# EAGLE design Bio-Belt_TH (EAGLE 5.06)
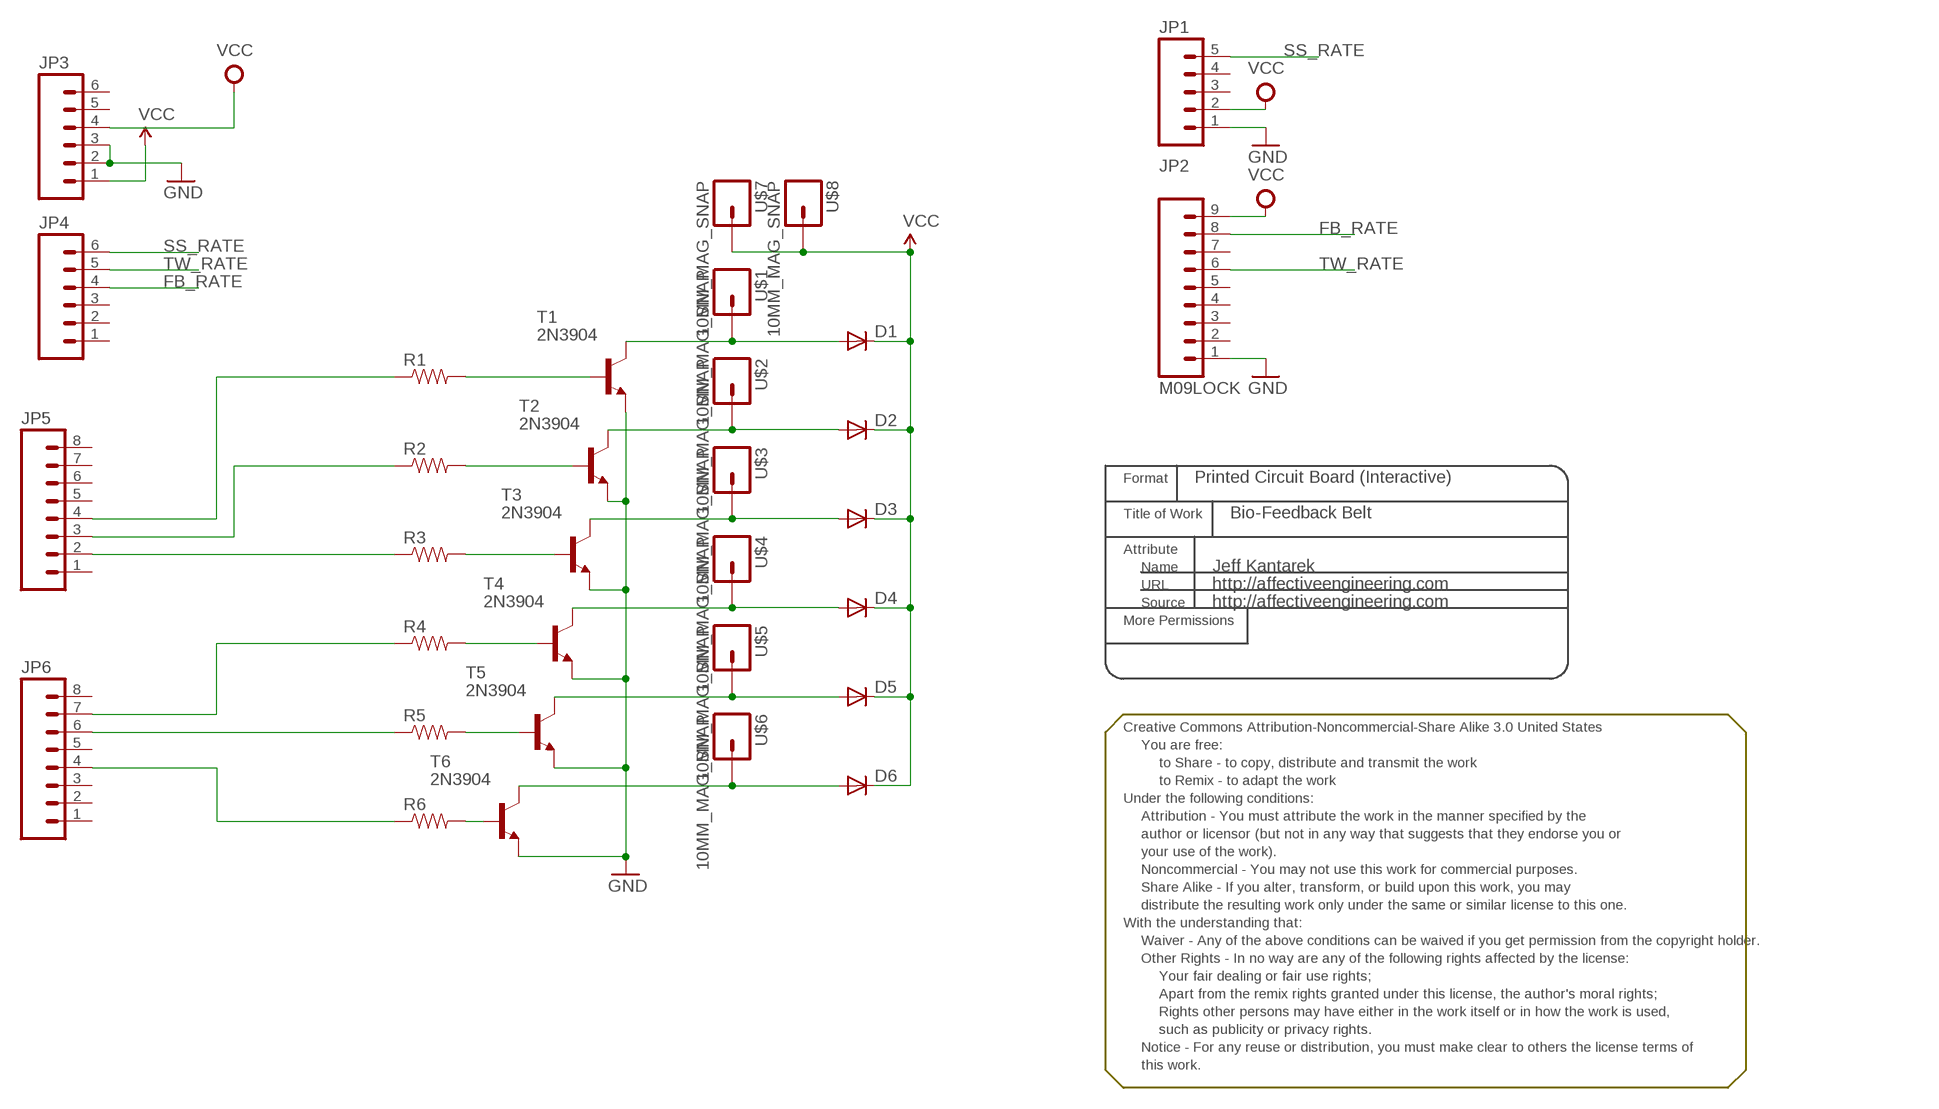
[diagram p0: schematic, sheet 1]

## Parts
D1  DIODEPTH  [DIODE-1N4001]
D2  DIODEPTH  [DIODE-1N4001]
D3  DIODEPTH  [DIODE-1N4001]
D4  DIODEPTH  [DIODE-1N4001]
D5  DIODEPTH  [DIODE-1N4001]
D6  DIODEPTH  [DIODE-1N4001]
JP1  M05LOCK  [1X05_LOCK]
JP2  M09LOCK  [1X09_LOCK]
JP3  M06LOCK  [1X06_LOCK]
JP4  M06LOCK  [1X06_LOCK]
JP5  M08LOCK  [1X08_LOCK]
JP6  M08LOCK  [1X08_LOCK]
R1  RESISTORPTH1  [AXIAL-0.3]
R2  RESISTORPTH1  [AXIAL-0.3]
R3  RESISTORPTH1  [AXIAL-0.3]
R4  RESISTORPTH1  [AXIAL-0.3]
R5  RESISTORPTH1  [AXIAL-0.3]
R6  RESISTORPTH1  [AXIAL-0.3]
T1  2N3904  [TO92]
T2  2N3904  [TO92]
T3  2N3904  [TO92]
T4  2N3904  [TO92]
T5  2N3904  [TO92]
T6  2N3904  [TO92]
U$1  10MM_MAG_SNAP  [SN1X01]
U$2  10MM_MAG_SNAP  [SN1X01]
U$3  10MM_MAG_SNAP  [SN1X01]
U$4  10MM_MAG_SNAP  [SN1X01]
U$5  10MM_MAG_SNAP  [SN1X01]
U$6  10MM_MAG_SNAP  [SN1X01]
U$7  10MM_MAG_SNAP  [SN1X01]
U$8  10MM_MAG_SNAP  [SN1X01]
U$10  CC_AT_NC_SA  [CC_AT_SA_NC]

## Nets
FB_RATE: JP2.8 JP4.4
GND: JP1.1 JP2.1 JP3.2 JP3.3 T1.3(E) T2.3(E) T3.3(E) T4.3(E) T5.3(E) T6.3(E)
N$1: D1.A T1.1(C) U$1.P$5
N$2: D2.A T2.1(C) U$2.P$5
N$3: D3.A T3.1(C) U$3.P$5
N$4: D4.A T4.1(C) U$4.P$5
N$5: D5.A T5.1(C) U$5.P$5
N$6: D6.A T6.1(C) U$6.P$5
N$8: R1.P$2 T1.2(B)
N$9: R2.P$2 T2.2(B)
N$10: R3.P$2 T3.2(B)
N$11: R4.P$2 T4.2(B)
N$12: R5.P$2 T5.2(B)
N$13: R6.P$2 T6.2(B)
N$14: JP5.4 R1.P$1
N$15: JP5.3 R2.P$1
N$16: JP5.2 R3.P$1
N$17: JP6.7 R4.P$1
N$18: JP6.6 R5.P$1
N$19: JP6.4 R6.P$1
SS_RATE: JP1.5 JP4.6
TW_RATE: JP2.6 JP4.5
VCC: JP1.2 JP2.9 JP3.4
VIN: D1.C D2.C D3.C D4.C D5.C D6.C JP3.1 U$7.P$5 U$8.P$5 ; supply symbol labelled VCC
Unconnected: JP1.3 JP1.4 JP2.2 JP2.3 JP2.4 JP2.5 JP2.7 JP3.5 JP3.6 JP4.1 JP4.2 JP4.3 JP5.1 JP5.5 JP5.6 JP5.7 JP5.8 JP6.1 JP6.2 JP6.3 JP6.5 JP6.8

## Notes on the sheet
- Printed Circuit Board (Interactive)
- Bio-Feedback Belt
- Jeff Kantarek
- http://affectiveengineering.com
- http://affectiveengineering.com

## Library data of the parts
D1-D6 = SparkFun:DIODE: Diode These are standard reverse protection diodes and small signal diodes. SMA package can handle up to about 1A. SOD-323 can handle about 200mA. What the SOD-323 package when ordering, there are some mfgs out there that are 5-pin packages.
JP1 = SparkFun:M05: Header 5 Standard 5-pin 0.1" header. Use with straight break away headers (SKU : PRT-00116), right angle break away headers (PRT-00553), swiss pins (PRT-00743), machine pins (PRT-00117), and female headers (PRT-00115). Molex polarized connector foot print use with SKU : PRT-08230 with associated crimp pins and housings.
JP2 = SparkFun:M09: Header 9 Standard 9-pin 0.1" header. Use with straight break away headers (SKU : PRT-00116), right angle break away headers (PRT-00553), swiss pins (PRT-00743), machine pins (PRT-00117), and female headers (PRT-00115).
JP3 JP4 = SparkFun:M06: Header 6 Standard 6-pin 0.1" header. Use with straight break away headers (SKU : PRT-00116), right angle break away headers (PRT-00553), swiss pins (PRT-00743), machine pins (PRT-00117), and female headers (PRT-00115). Molex polarized connector foot print use with SKU : PRT-08094 with associated crimp pins and housings. NOTES ON THE VARIANTS LOCK and LOCK_LONGPADS... This footprint was designed to help hold the alignment of a through-hole component (i.e. 6-pin header) while soldering it into place. You may notice that each hole has been shifted either up or down by 0.005 of an inch from it's more standard position (which is a perfectly straight line). This slight alteration caused the pins (the squares in the middle) to touch the edges of the holes. Because they are alternating, it causes a "brace" to hold the component in place. 0.005 has proven to be the perfect amount of "off-center" position when using our standard breakaway headers. Although looks a little odd when you look at the bare footprint, once you have a header in there, the alteration is very hard to notice. Also, if you push a header all the way into place, it is covered up entirely on the bottom side. This idea of altering the position of holes to aid alignment will be further integrated into the Sparkfun Library for other footprints. It can help hold any component with 3 or more connection pins.
JP5 JP6 = SparkFun:M08: Header 8 Standard 8-pin 0.1" header. Use with straight break away headers (SKU : PRT-00116), right angle break away headers (PRT-00553), swiss pins (PRT-00743), machine pins (PRT-00117), and female headers (PRT-00115).
R1-R6 = SparkFun:RESISTOR: Resistor Basic schematic elements and footprints for 0603, 1206, and PTH 1/10th watt (small) resistors.
T1-T6 = transistor:2N3904: NPN TRANSISTOR
U$1-U$8 = SparkFun:10MM_MAG_SNAP
U$10 = PumpingStation-One:CC_AT_NC_SA: Creative Commons Attribution-Noncommercial-Share Alike 3.0 United States us You are free: * to Share ? to copy, distribute and transmit the work * to Remix ? to adapt the work * Under the following conditions: * Attribution ? You must attribute the work in the manner specified by the author or licensor (but not in any way that suggests that they endorse you or your use of the work). Attribute this work: Information What does "Attribute this work" mean? The page you came from contained embedded licensing metadata, including how the creator wishes to be attributed for re-use. You can use the HTML here to cite the work. Doing so will also include metadata on your page so that others can find the original work as well. * Noncommercial ? You may not use this work for commercial purposes. * Share Alike ? If you alter, transform, or build upon this work, you may distribute the resulting work only under the same or similar license to this one. With the understanding that: * Waiver ? Any of the above conditions can be waived if you get permission from the copyright holder. * Other Rights ? In no way are any of the following rights affected by the license: o Your fair dealing or fair use rights; o Apart from the remix rights granted under this license, the author's moral rights; o Rights other persons may have either in the work itself or in how the work is used, such as publicity or privacy rights. * Notice ? For any reuse or distribution, you must make clear to others the license terms of this work. The best way to do this is with a link to this web page.

## Board
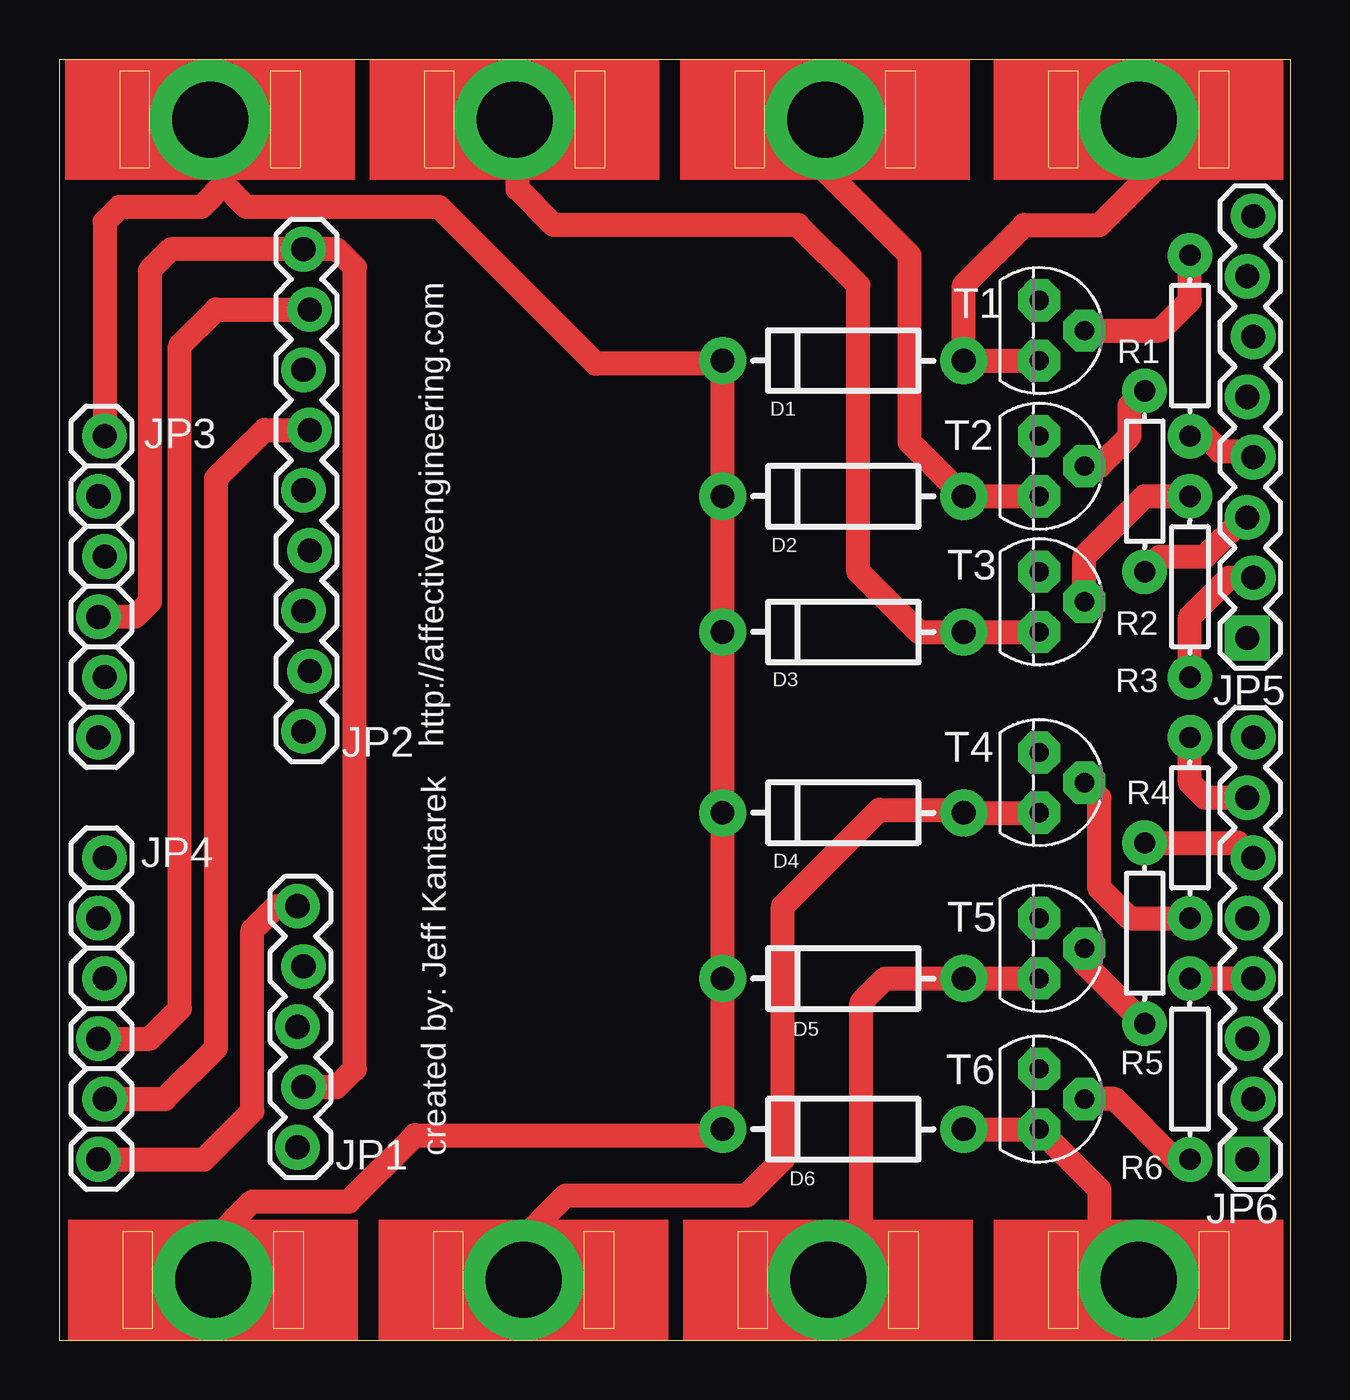
[diagram p1: board, top side]
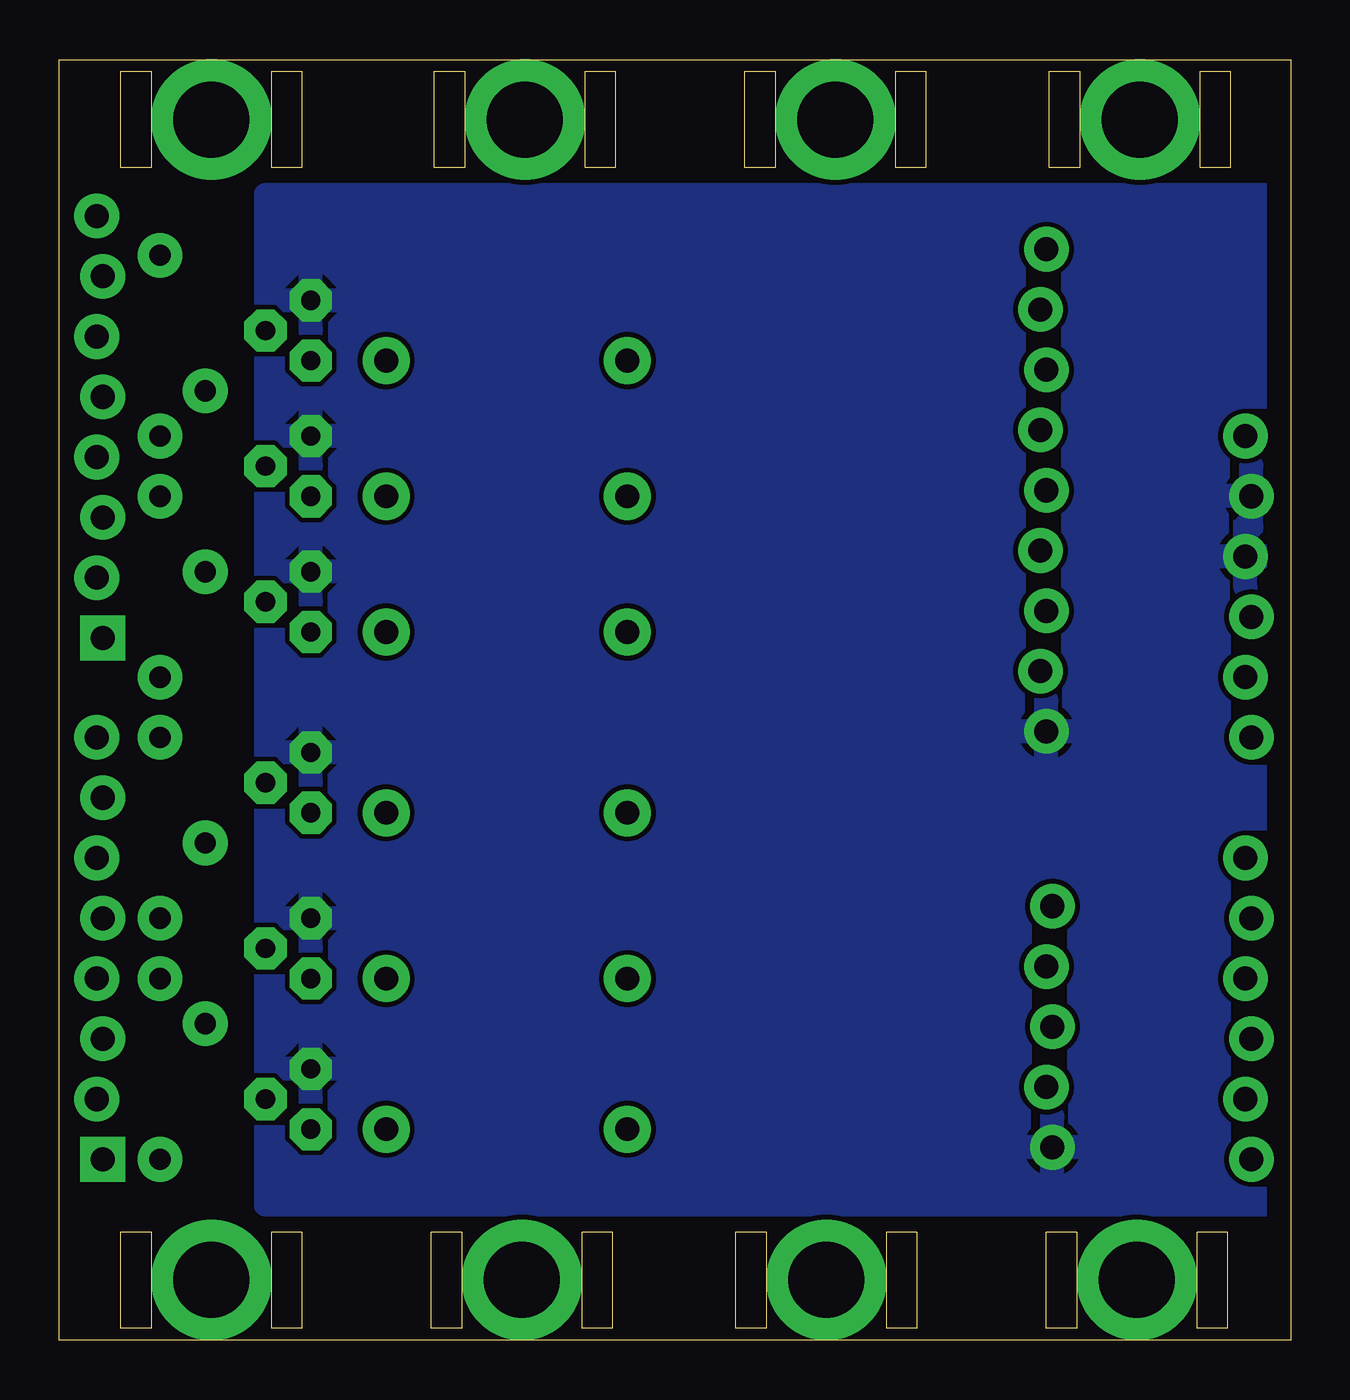
[diagram p2: board, bottom side, seen from below]

Size 51.87 x 53.97 mm. Coordinates in mm from the lower left corner, seen from the top.
Outline: 0,0 51.87,0 51.87,53.97 0,53.97 0,0
Copper layers (1*16): Top 0.035mm / dielectric 1.5mm / Bottom 0.035mm
Design rules "default": minimum track width 10mil, minimum drill 24mil, track to track 8mil, track to pad 8mil, pad to pad 8mil, via to via 8mil, smd to smd 8mil, copper to edge 40mil, drill to drill 8mil, minimum pad ring 10mil, minimum via ring 8mil, stop-mask expansion 4mil, vias tented up to drill 0mil, thermal gap 10mil

### Footprints (pad centres in the part's own frame; a part is rotated, then mirrored left to right if it is on the bottom)
DIODE-1N4001 = drill 1 pad 1.981 round: A -5.08,0; C 5.08,0
1X05_LOCK = drill 1.016 pad 1.88 round: 1 0,0.127; 2 2.54,-0.127; 3 5.08,0.127; 4 7.62,-0.127; 5 10.16,0.127
1X09_LOCK = drill 1.016 pad 1.88 round: 1 0,0.127; 2 2.54,-0.127; 3 5.08,0.127; 4 7.62,-0.127; 5 10.16,0.127; 6 12.7,-0.127; 7 15.24,0.127; 8 17.78,-0.127; 9 20.32,0.127
1X06_LOCK = drill 1.016 pad 1.88 round: 1 0,0; 2 2.54,-0.254; 3 5.08,0; 4 7.62,-0.254; 5 10.16,0; 6 12.7,-0.254
1X08_LOCK = drill 1.016 pad 1.88 square: 1 0,0.127 | drill 1.016 pad 1.88 round: 2 2.54,-0.127; 3 5.08,0.127; 4 7.62,-0.127; 5 10.16,0.127; 6 12.7,-0.127; 7 15.24,0.127; 8 17.78,-0.127
AXIAL-0.3 = drill 0.9 pad 1.88 round: P$1 -3.81,0; P$2 3.81,0
TO92 = drill 0.813 pad 1.778 octagon: 1 1.27,0; 2 0,1.905; 3 -1.27,0
SN1X01 = drill 3.2 pad 5.08 round: P$5 0,0

### Placement (x,y rotation side)
D1  33.02,41.27 180 top
D2  33.02,35.56 180 top
D3  33.02,29.84 180 top
D4  33.02,22.23 180 top
D5  33.02,15.24 180 top
D6  33.02,8.89 180 top
JP1  10.16,8.13 90 top
JP2  10.41,25.65 90 top
JP3  1.91,38.1 270 top
JP4  1.91,20.32 270 top
JP5  50.16,29.59 90 top
JP6  50.16,7.62 90 top
R1  47.62,41.91 90 top
R2  45.72,36.2 90 top
R3  47.62,31.75 90 top
R4  47.62,21.59 270 top
R5  45.72,17.14 270 top
R6  47.62,11.43 270 top
T1  41.27,42.55 270 top
T2  41.27,36.83 270 top
T3  41.27,31.11 270 top
T4  41.27,23.5 270 top
T5  41.27,16.51 270 top
T6  41.27,10.16 270 top
U$1  45.47,51.44 90 top
U$2  32.26,51.44 90 top
U$3  19.18,51.44 90 top
U$4  19.56,2.54 90 top
U$5  32.38,2.54 90 top
U$6  45.47,2.54 90 top
U$7  6.35,51.44 90 top
U$8  6.48,2.54 90 top
U$9  [SHOCK_LOGO]  24.92,31.85 90 top
U$10  22.35,23.62 90 top

### Tracks (layer width: path | path; a pad name or v marks a point on that pad's centre or on a via)
FB_RATE
  Top 1.016: JP4.4 3.81,12.7 5.08,13.97 5.08,41.91 6.6,43.43 JP2.8
GND
  pour Bottom: -3.81,48.26 43.18,48.26 43.18,5.71 -3.81,5.71
N$1
  Top 1.016: T1.1 D1.A 38.1,44.45 40.64,46.99 43.81,46.99 46.99,50.16 U$1.P$5
N$2
  Top 1.016: T2.1 D2.A 35.81,37.85 35.81,45.72 32,49.53 U$2.P$5
N$3
  Top 1.016: T3.1 D3.A 36.2,29.84 33.66,32.38 33.66,44.45 31.11,46.99 20.83,46.99 19.3,48.51 19.3,51.31 U$3.P$5 20.32,52.7
N$4
  Top 1.016: T4.1 D4.A 37.97,22.35 34.54,22.35 30.48,18.29 30.48,7.62 28.96,6.1 21.34,6.1 19.3,4.06 U$4.P$5
N$5
  Top 1.016: T5.1 D5.A 34.8,15.24 33.78,14.22 33.78,4.19 U$5.P$5
N$6
  Top 1.016: D6.A T6.1 43.81,6.35 43.81,3.81 U$6.P$5
N$8
  Top 1.016: T1.2 46.35,42.55 47.62,43.81 R1.P$2
N$9
  Top 1.016: T2.2 43.81,36.83 45.09,38.1 45.09,39.37 R2.P$2
N$10
  Top 1.016: T3.2 43.18,33.02 45.72,35.56 R3.P$2
N$11
  Top 1.016: R4.P$2 45.09,17.78 43.81,19.05 43.81,22.86 T4.2
N$12
  Top 1.016: T5.2 43.18,15.88 R5.P$2
N$13
  Top 1.016: R6.P$2 46.99,7.62 44.45,10.16 T6.2
N$14
  Top 1.016: R1.P$1 48.26,38.1 48.9,37.47 50.04,37.47 JP5.4
N$15
  Top 1.016: JP5.3 49.91,34.67 48.26,33.02 46.35,33.02 R2.P$1
N$16
  Top 1.016: JP5.2 49.28,32.13 47.62,30.48 R3.P$1
N$17
  Top 1.016: R4.P$1 47.62,23.5 48.26,22.86 JP6.7
N$18
  Top 1.016: R5.P$1 49.66,20.95 JP6.6
N$19
  Top 1.016: R6.P$1 JP6.4
SS_RATE
  Top 1.016: JP1.5 9.14,18.29 8.13,17.27 8.13,9.65 6.1,7.62 JP4.6
TW_RATE
  Top 1.016: JP4.5 4.45,10.16 6.6,12.32 6.6,36.32 8.64,38.35 JP2.6
VCC
  Top 1.016: JP3.4 3.17,30.48 3.81,31.11 3.81,45.09 4.7,45.97 JP2.9 11.68,45.97 12.45,45.21 12.45,11.43 11.68,10.67 JP1.2
VIN
  Top 1.016: 6.99,48.77 U$7.P$5 | U$8.P$5 6.48,4.19 8.13,5.84 12.19,5.84 14.99,8.64 27.69,8.64 D6.C D5.C D4.C D3.C D2.C D1.C 27.81,41.15 22.61,41.15 16,47.75 7.87,47.75 6.99,48.64 6.99,48.77 | JP3.1 1.91,47.12 2.54,47.75 5.97,47.75 6.99,48.77

### Text on the board
tNames: http://affectiveengineering.com | created by: Jeff Kantarek